# Altium schematic sheet Page C_ExCONNECTOR.SchDoc
size 386 x 246 mm; SheetNumber: 0; SheetTotal: 0
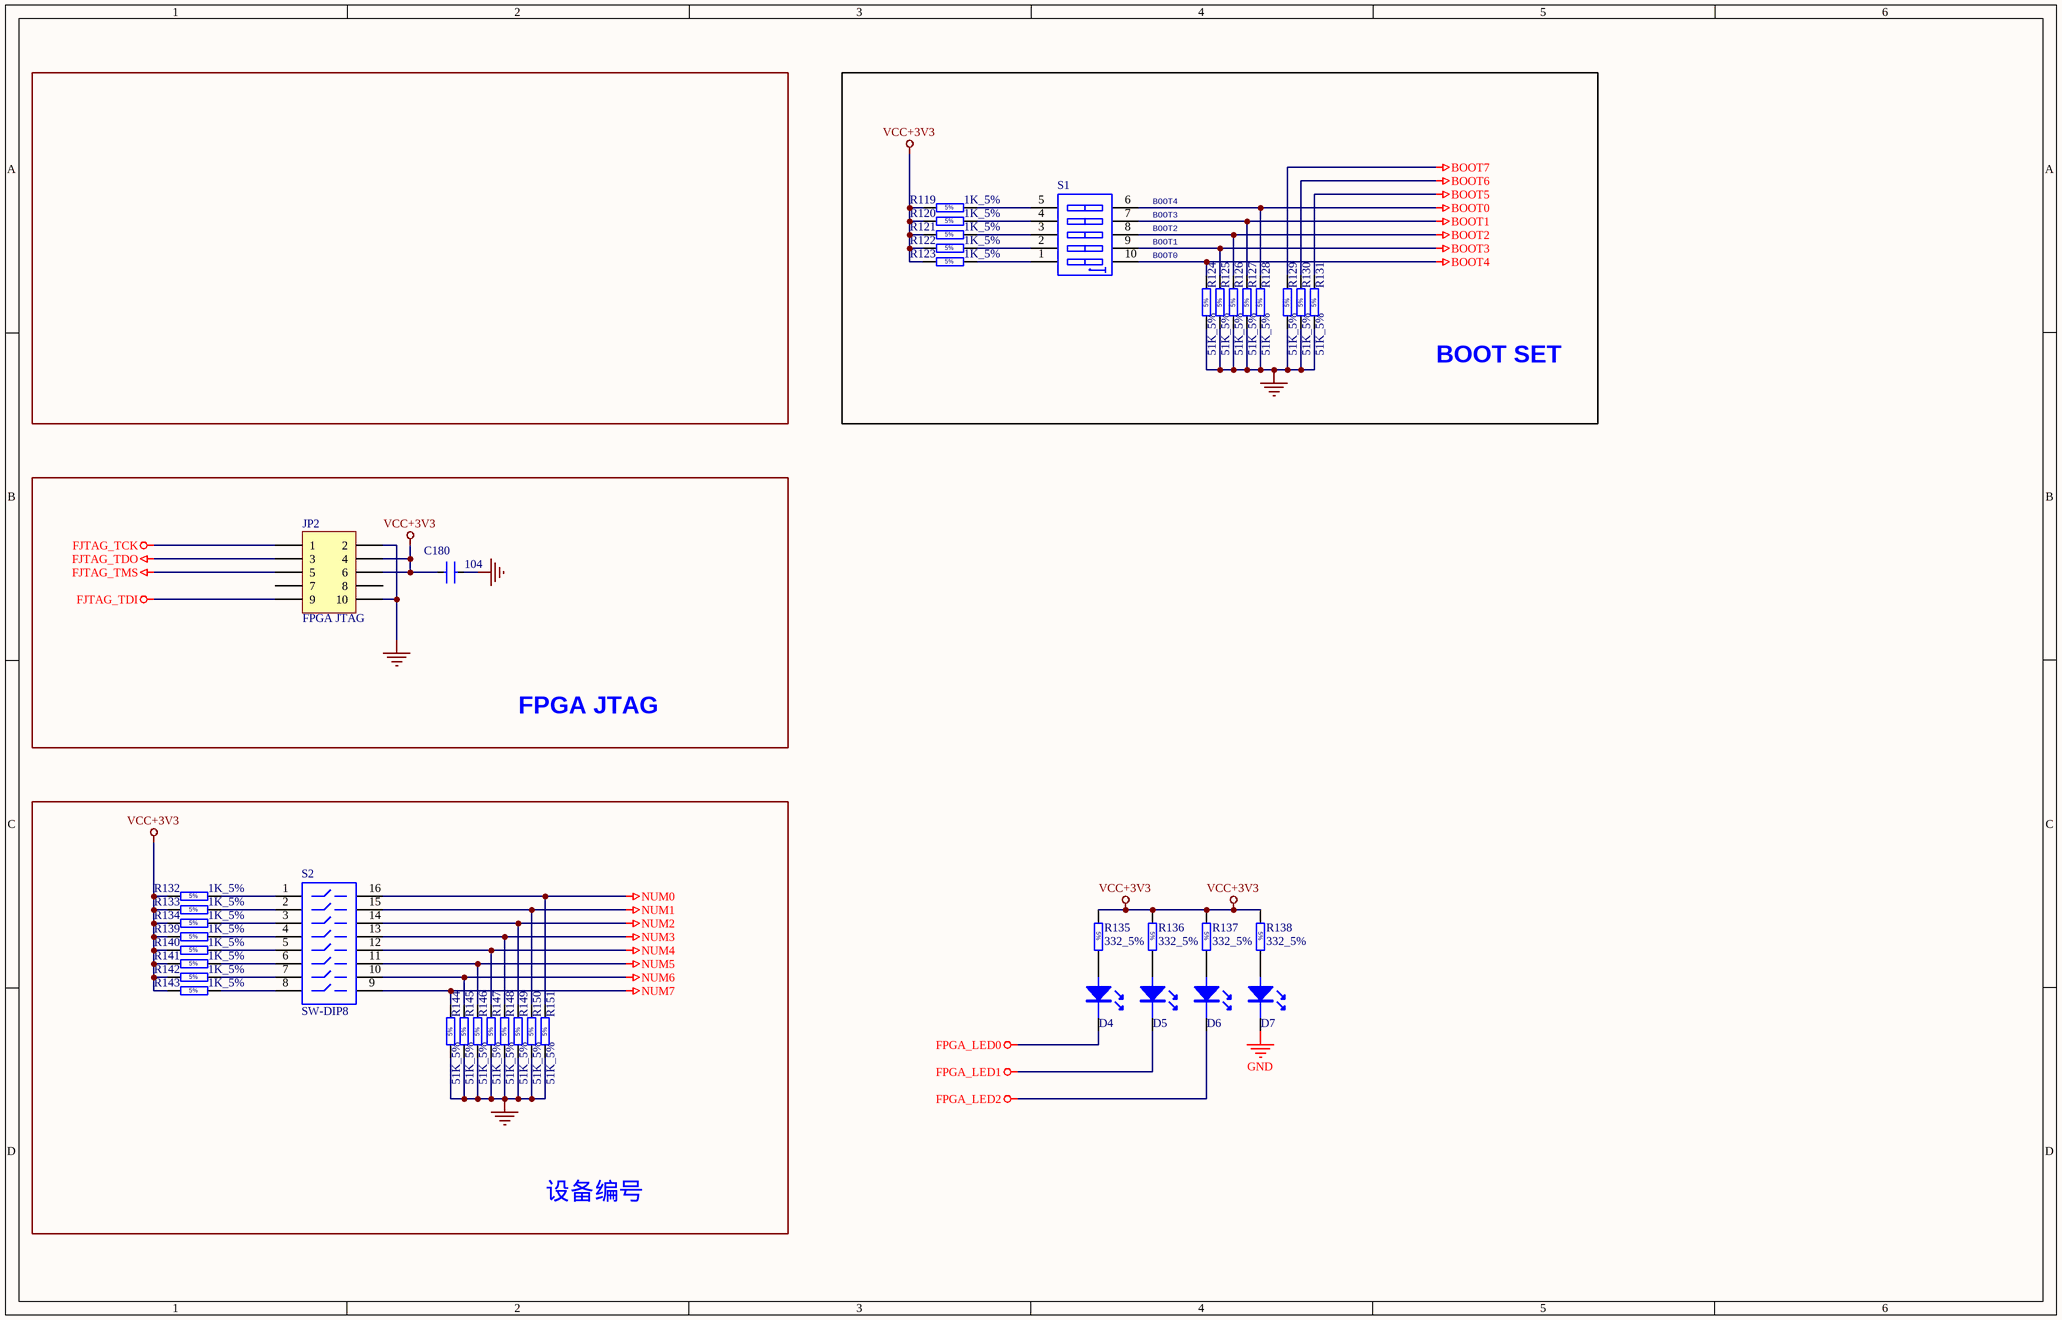
[diagram p0: Page C_ExCONNECTOR.SchDoc]

## Parts
C180  104  [0603C]
D4  LED  [0805-LED]  (value not drawn)
D5  LED  [0805-LED]  (value not drawn)
D6  LED  [0805-LED]  (value not drawn)
D7  LED  [0805-LED]  (value not drawn)
JP2  FPGA JTAG  [HDR2X5]
R119  1K_5%  [0603R]
R120  1K_5%  [0603R]
R121  1K_5%  [0603R]
R122  1K_5%  [0603R]
R123  1K_5%  [0603R]
R124  51K_5%  [0603R]
R125  51K_5%  [0603R]
R126  51K_5%  [0603R]
R127  51K_5%  [0603R]
R128  51K_5%  [0603R]
R129  51K_5%  [0603R]
R130  51K_5%  [0603R]
R131  51K_5%  [0603R]
R132  1K_5%  [0603R]
R133  1K_5%  [0603R]
R134  1K_5%  [0603R]
R135  332_5%  [0603R]
R136  332_5%  [0603R]
R137  332_5%  [0603R]
R138  332_5%  [0603R]
R139  1K_5%  [0603R]
R140  1K_5%  [0603R]
R141  1K_5%  [0603R]
R142  1K_5%  [0603R]
R143  1K_5%  [0603R]
R144  51K_5%  [0603R]
R145  51K_5%  [0603R]
R146  51K_5%  [0603R]
R147  51K_5%  [0603R]
R148  51K_5%  [0603R]
R149  51K_5%  [0603R]
R150  51K_5%  [0603R]
R151  51K_5%  [0603R]
S1  SW DIP-5  [SW5-SO]  (value not drawn)
S2  SW-DIP8  [SW8-SO]

## Blocks framed on the sheet
BOOT SET: R119-R131 S1
FPGA JTAG: C180 JP2
设备编号: R132-R134 R139-R151 S2

## Nets
BOOT0: R128.2 S1.6(B5)
BOOT1: R127.2 S1.7(B4)
BOOT2: R126.2 S1.8(B3)
BOOT3: R125.2 S1.9(B2)
BOOT4: R124.2 S1.10(B1)
BOOT5: R131.2
BOOT6: R130.2
BOOT7: R129.2
FJTAG_TCK: JP2.1
FJTAG_TDI: JP2.9
FJTAG_TDO: JP2.3
FJTAG_TMS: JP2.5
FPGA_LED0: D4.K
FPGA_LED1: D5.K
FPGA_LED2: D6.K
GND: C180.2 D7.K JP2.2 JP2.10 R124.1 R125.1 R126.1 R127.1 R128.1 R129.1 R130.1 R131.1 R144.1 R145.1 R146.1 R147.1 R148.1 R149.1 R150.1 R151.1
NUM0: R151.2 S2.16
NUM1: R150.2 S2.15
NUM2: R149.2 S2.14
NUM3: R148.2 S2.13
NUM4: R147.2 S2.12
NUM5: R146.2 S2.11
NUM6: R145.2 S2.10
NUM7: R144.2 S2.9
VCC+3V3: C180.1 JP2.4 JP2.6 R119.1 R120.1 R121.1 R122.1 R123.1 R132.1 R133.1 R134.1 R135.1 R136.1 R137.1 R138.1 R139.1 R140.1 R141.1 R142.1 R143.1
NetD4_A: D4.A R135.2
NetD5_A: D5.A R136.2
NetD6_A: D6.A R137.2
NetD7_A: D7.A R138.2
NetR119_2: R119.2 S1.5(A5)
NetR120_2: R120.2 S1.4(A4)
NetR121_2: R121.2 S1.3(A3)
NetR122_2: R122.2 S1.2(A2)
NetR123_2: R123.2 S1.1(A1)
NetR132_2: R132.2 S2.1
NetR133_2: R133.2 S2.2
NetR134_2: R134.2 S2.3
NetR139_2: R139.2 S2.4
NetR140_2: R140.2 S2.5
NetR141_2: R141.2 S2.6
NetR142_2: R142.2 S2.7
NetR143_2: R143.2 S2.8

Not connected (* = marked no-connect by the designer): JP2 7 8

## Notes on the sheet
- BOOT0
- BOOT1
- BOOT2
- (near S1) BOOT3
- (near S1) BOOT4
- (in symbol Resistor - 5%) 5%

## Library data of the parts
C180 = C-X5R/X7R
JP2 = Header 5X2: Header, 5-Pin, Dual row; LatestRevisionDate: 17-Jul-2002; LatestRevisionNote: Re-released for DXP Platform.; Publisher: Altium Limited
R119-R151 = Resistor - 5%
S1 = SW DIP-5: DIP Switch